# Altium schematic sheet input_filter.SchDoc
size A3; DocumentNumber: 3; SheetNumber: 3; SheetTotal: 11; SheetDescription: Cell Input Filter
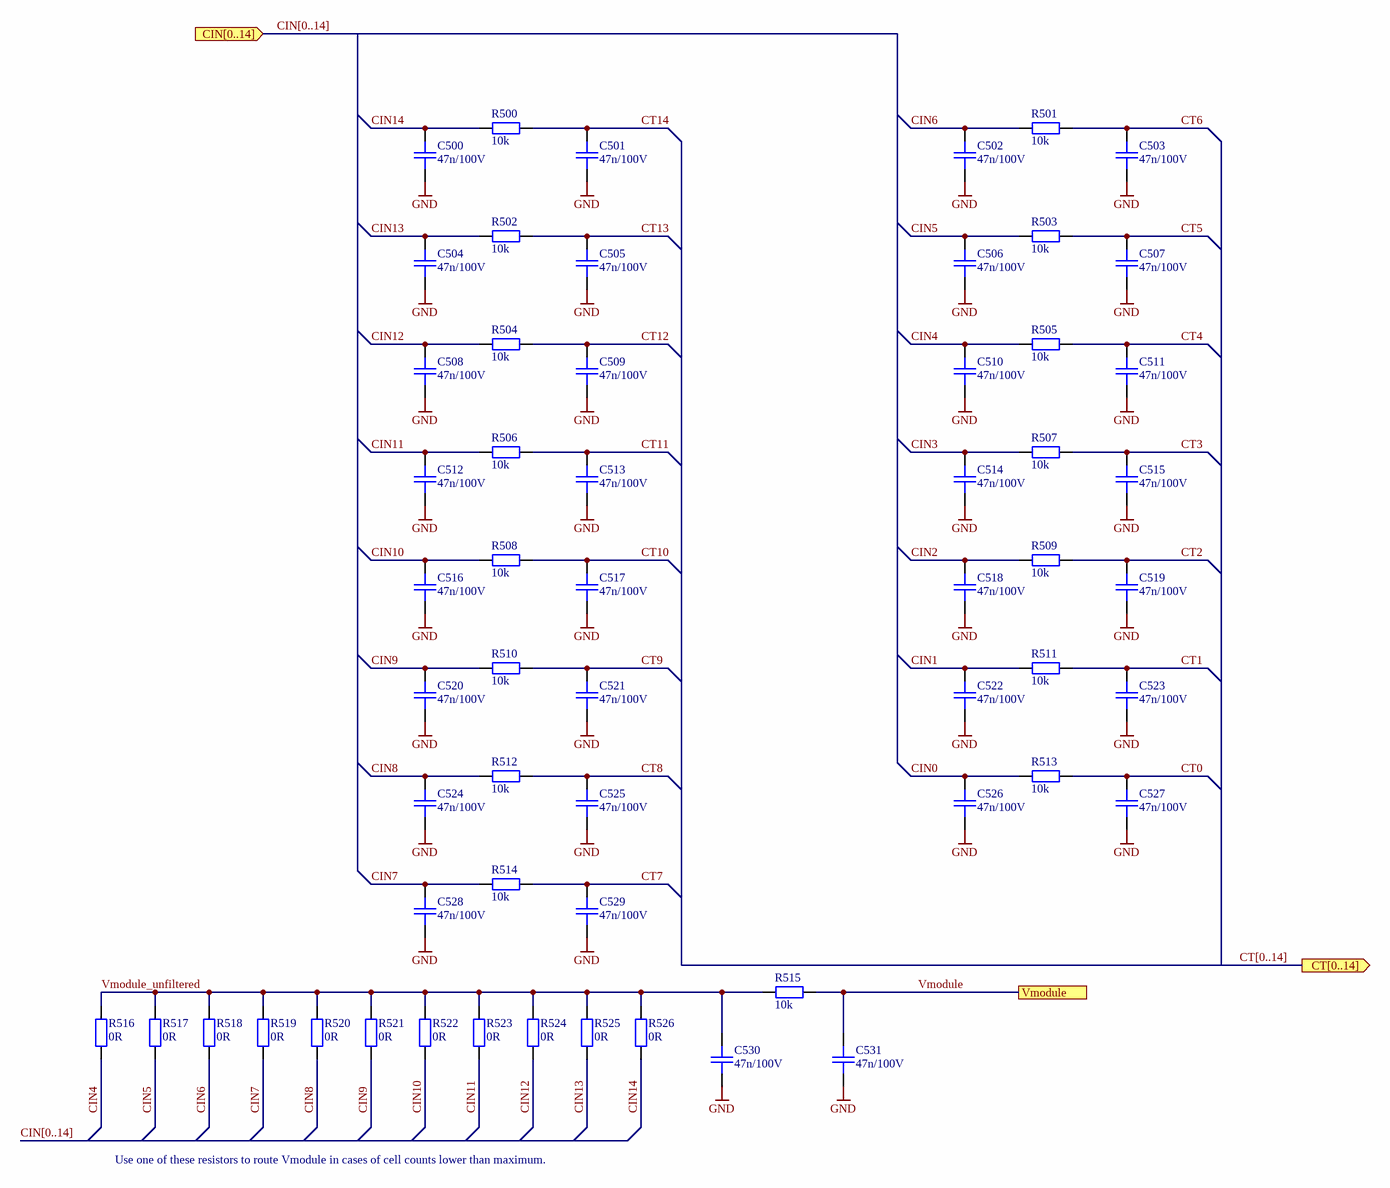
[diagram p0: input_filter.SchDoc]

## Parts
C500  47n/100V  [CAPC1608X08N]
C501  47n/100V  [CAPC1608X08N]
C502  47n/100V  [CAPC1608X08N]
C503  47n/100V  [CAPC1608X08N]
C504  47n/100V  [CAPC1608X08N]
C505  47n/100V  [CAPC1608X08N]
C506  47n/100V  [CAPC1608X08N]
C507  47n/100V  [CAPC1608X08N]
C508  47n/100V  [CAPC1608X08N]
C509  47n/100V  [CAPC1608X08N]
C510  47n/100V  [CAPC1608X08N]
C511  47n/100V  [CAPC1608X08N]
C512  47n/100V  [CAPC1608X08N]
C513  47n/100V  [CAPC1608X08N]
C514  47n/100V  [CAPC1608X08N]
C515  47n/100V  [CAPC1608X08N]
C516  47n/100V  [CAPC1608X08N]
C517  47n/100V  [CAPC1608X08N]
C518  47n/100V  [CAPC1608X08N]
C519  47n/100V  [CAPC1608X08N]
C520  47n/100V  [CAPC1608X08N]
C521  47n/100V  [CAPC1608X08N]
C522  47n/100V  [CAPC1608X08N]
C523  47n/100V  [CAPC1608X08N]
C524  47n/100V  [CAPC1608X08N]
C525  47n/100V  [CAPC1608X08N]
C526  47n/100V  [CAPC1608X08N]
C527  47n/100V  [CAPC1608X08N]
C528  47n/100V  [CAPC1608X08N]
C529  47n/100V  [CAPC1608X08N]
C530  47n/100V  [CAPC1608X08N]
C531  47n/100V  [CAPC1608X08N]
R500  10k  [RESC1608X05N]
R501  10k  [RESC1608X05N]
R502  10k  [RESC1608X05N]
R503  10k  [RESC1608X05N]
R504  10k  [RESC1608X05N]
R505  10k  [RESC1608X05N]
R506  10k  [RESC1608X05N]
R507  10k  [RESC1608X05N]
R508  10k  [RESC1608X05N]
R509  10k  [RESC1608X05N]
R510  10k  [RESC1608X05N]
R511  10k  [RESC1608X05N]
R512  10k  [RESC1608X05N]
R513  10k  [RESC1608X05N]
R514  10k  [RESC1608X05N]
R515  10k  [RESC1608X05N]
R516  0R  [RESC1608X05N]
R517  0R  [RESC1608X05N]
R518  0R  [RESC1608X05N]
R519  0R  [RESC1608X05N]
R520  0R  [RESC1608X05N]
R521  0R  [RESC1608X05N]
R522  0R  [RESC1608X05N]
R523  0R  [RESC1608X05N]
R524  0R  [RESC1608X05N]
R525  0R  [RESC1608X05N]
R526  0R  [RESC1608X05N]

## Ports
CIN[0..14] (in), CT[0..14] (out), Vmodule

## Nets
GND: C500.1 C501.1 C502.1 C503.1 C504.1 C505.1 C506.1 C507.1 C508.1 C509.1 C510.1 C511.1 C512.1 C513.1 C514.1 C515.1 C516.1 C517.1 C518.1 C519.1 C520.1 C521.1 C522.1 C523.1 C524.1 C525.1 C526.1 C527.1 C528.1 C529.1 C530.1 C531.1
CIN0: C526.2 R513.2
CIN1: C522.2 R511.2
CIN2: C518.2 R509.2
CIN3: C514.2 R507.2
CIN4: C510.2 R505.2 R516.1
CIN5: C506.2 R503.2 R517.1
CIN6: C502.2 R501.2 R518.1
CIN7: C528.2 R514.2 R519.1
CIN8: C524.2 R512.2 R520.1
CIN9: C520.2 R510.2 R521.1
CIN10: C516.2 R508.2 R522.1
CIN11: C512.2 R506.2 R523.1
CIN12: C508.2 R504.2 R524.1
CIN13: C504.2 R502.2 R525.1
CIN14: C500.2 R500.2 R526.1
CT0: C527.2 R513.1
CT1: C523.2 R511.1
CT2: C519.2 R509.1
CT3: C515.2 R507.1
CT4: C511.2 R505.1
CT5: C507.2 R503.1
CT6: C503.2 R501.1
CT7: C529.2 R514.1
CT8: C525.2 R512.1
CT9: C521.2 R510.1
CT10: C517.2 R508.1
CT11: C513.2 R506.1
CT12: C509.2 R504.1
CT13: C505.2 R502.1
CT14: C501.2 R500.1
Vmodule: C531.2 R515.1 ; port Vmodule
Vmodule_unfiltered: C530.2 R515.2 R516.2 R517.2 R518.2 R519.2 R520.2 R521.2 R522.2 R523.2 R524.2 R525.2 R526.2

## Buses and harness runs
bus CIN[0..14]
bus CIN[0..14] = port CIN[0..14]
bus CT[0..14] = port CT[0..14]

## Notes on the sheet
- Use one of these resistors to route Vmodule in cases of cell counts lower than maximum.
- Fraunhofer IISB
- Schottkystr. 10
- developed by:
- 91058 Erlangen
- Germany
- Author
- Project
- License
- Description
- File
- Version
- Release Date
- Sheet
- foxbms.org <https://foxbms.org>
- www.iisb.fraunhofer.de <https://www.iisb.fraunhofer.de/>
- foxBMS Team
- /

## Library data of the parts
C500-C531 = gen_C_ceramic_47n_100V_X7R_0603: MLCC; Capacitance: 47n; Rated Voltage: 100V; Dielectric: X7R; Case EIA: 0603; Case Metric: 1608; Automotive Qualified: True; PnP Package: 0603C; Part Number: gen_C_ceramic_47n_100V_X7R_0603; Supplier 1: Farnell; Supplier Part Number 1: 2478249; Supplier 2: Farnell; Supplier Part Number 2: 2708699; Supplier 3: Farnell; Supplier Part Number 3: 2905110
R500-R515 = gen_R_10k_0603: SMD Resistor 10k 0603; Tolerance: 1%; Power: 0.1W; Case EIA: 0603; Case Metric: 1608; Maximum Working Voltage: 75V; PnP Package: 0603R; Automotive Qualified: True; Part Number: gen_R_10k_0603; Operating Temperature: -55°C - +155°C; Resistance: 10k; Series: E24, E96; PnP Value: 10k; Supplier 1: Farnell; Supplier Part Number 1: 2073349
R516-R526 = gen_R_0R_0603: SMD Resistor 0R 0603; Power: 0.1W; Case EIA: 0603; Case Metric: 1608; Maximum Working Voltage: 75V; PnP Package: 0603R; Automotive Qualified: True; PnP equipped: x; Part Number: gen_R_0R_0603; Operating Temperature: -55°C - +155°C; Resistance: 0R; Series: Jumper; PnP Value: 0R; Supplier 1: Farnell; Supplier Part Number 1: 2616580